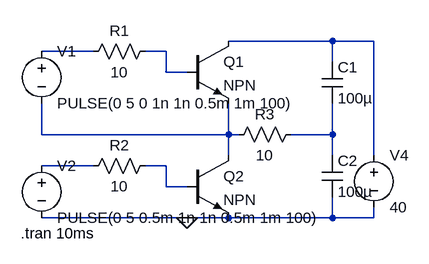
[diagram p0: schematic inverter_RC.asc]
inverter_RC.asc, the LTspice schematic file:
Version 4
SHEET 1 880 680
WIRE 352 48 192 48
WIRE 416 48 352 48
WIRE -16 64 -96 64
WIRE 96 64 64 64
WIRE 352 80 352 48
WIRE 96 96 96 64
WIRE 128 96 96 96
WIRE -96 192 -96 144
WIRE 192 192 192 144
WIRE 192 192 -96 192
WIRE 208 192 192 192
WIRE 352 192 352 144
WIRE 352 192 288 192
WIRE 192 224 192 192
WIRE 352 224 352 192
WIRE 416 224 416 48
WIRE -16 240 -96 240
WIRE 96 240 64 240
WIRE 96 272 96 240
WIRE 128 272 96 272
WIRE 128 320 -96 320
WIRE 192 320 128 320
WIRE 352 320 352 288
WIRE 352 320 192 320
WIRE 416 320 416 304
WIRE 416 320 352 320
FLAG 128 320 0
SYMBOL res 80 48 R90
WINDOW 0 0 56 VBottom 2
WINDOW 3 32 56 VTop 2
SYMATTR InstName R1
SYMATTR Value 10
SYMBOL res 80 224 R90
WINDOW 0 0 56 VBottom 2
WINDOW 3 32 56 VTop 2
SYMATTR InstName R2
SYMATTR Value 10
SYMBOL voltage -96 48 R0
WINDOW 123 0 0 Left 0
WINDOW 39 0 0 Left 0
SYMATTR InstName V1
SYMATTR Value PULSE(0 5 0 1n 1n 0.5m 1m 100)
SYMBOL voltage -96 224 R0
WINDOW 123 0 0 Left 0
WINDOW 39 0 0 Left 0
SYMATTR InstName V2
SYMATTR Value PULSE(0 5 0.5m 1n 1n 0.5m 1m 100)
SYMBOL voltage 416 208 R0
WINDOW 123 0 0 Left 0
WINDOW 39 0 0 Left 0
SYMATTR InstName V4
SYMATTR Value 40
SYMBOL npn 128 48 R0
SYMATTR InstName Q1
SYMBOL npn 128 224 R0
SYMATTR InstName Q2
SYMBOL cap 336 80 R0
SYMATTR InstName C1
SYMATTR Value 100µ
SYMBOL cap 336 224 R0
SYMATTR InstName C2
SYMATTR Value 100µ
SYMBOL res 304 176 R90
WINDOW 0 0 56 VBottom 2
WINDOW 3 32 56 VTop 2
SYMATTR InstName R3
SYMATTR Value 10
TEXT -128 344 Left 2 !.tran 10ms

The netlist it stands for:
* inverter_RC.asc
R1 N003 N002 10
R2 N007 N006 10
V1 N002 N004 PULSE(0 5 0 1n 1n 0.5m 1m 100)
V2 N006 0 PULSE(0 5 0.5m 1n 1n 0.5m 1m 100)
V4 N001 0 40
Q1 N001 N003 N004 0 NPN
Q2 N004 N007 0 0 NPN
C1 N001 N005 100µ
C2 N005 0 100µ
R3 N005 N004 10
.model NPN NPN
.model PNP PNP
.lib standard.bjt
.tran 10ms
.backanno
.end